# EasyEDA schematic Handheld.json
TITLE: Sheet_1; REV: 1.0; Date: 2025-04-20; Sheet: 1/1; Company: Your Company
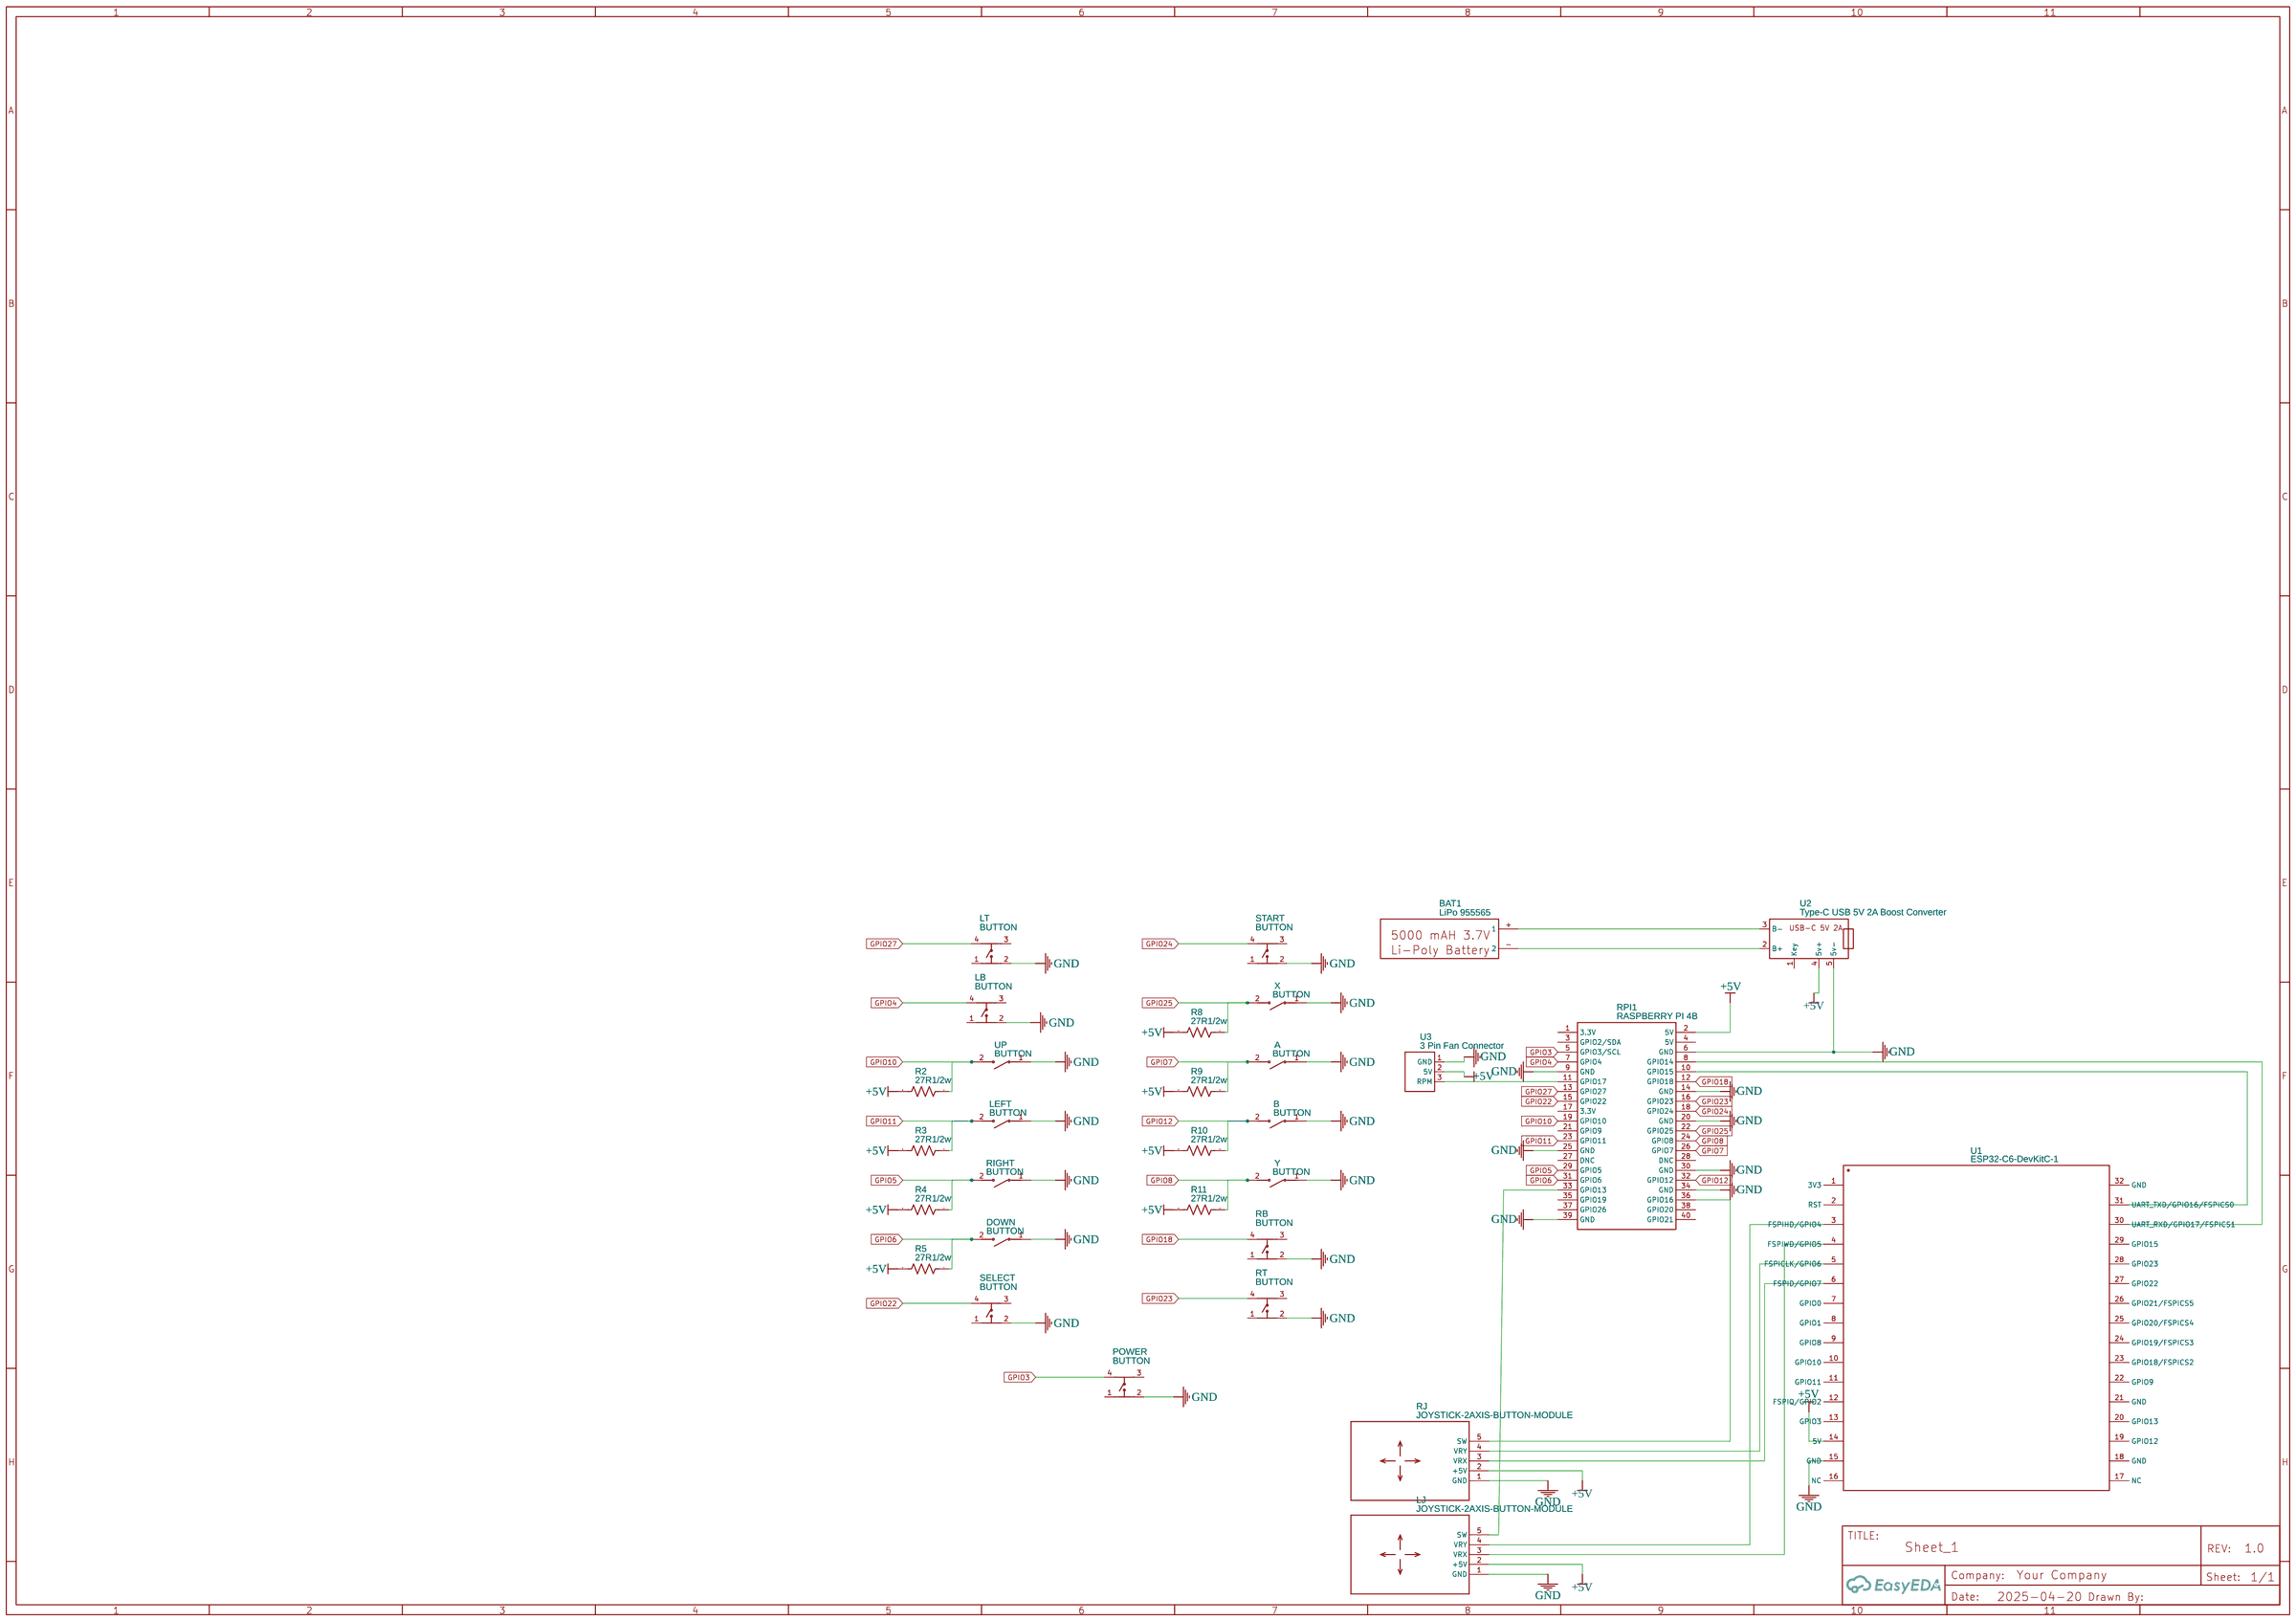
[diagram p0: schematic sheet]

## Parts
A  BUTTON  [SW-SMD_L3.9-W2.9-LS4.9-L]
B  BUTTON  [SW-SMD_L3.9-W2.9-LS4.9-L]
BAT1  LiPo 955565  [LIPO955565]
DOWN  BUTTON  [SW-SMD_L3.9-W2.9-LS4.9-L]
LB  BUTTON  [KEY-TH_4P-L6.0-W6.0-P4.50-LS7.5]
LEFT  BUTTON  [SW-SMD_L3.9-W2.9-LS4.9-L]
LJ  JOYSTICK-2AXIS-BUTTON-MODULE  [JOYSTICK-2AXIS-BUTTON-MODULE]
LT  BUTTON  [KEY-TH_4P-L6.0-W6.0-P4.50-LS7.5]
POWER  BUTTON  [KEY-TH_4P-L6.0-W6.0-P4.50-LS7.5]
R2  27R1/2w  [DC-RESISTOR-0.5W]
R3  27R1/2w  [DC-RESISTOR-0.5W]
R4  27R1/2w  [DC-RESISTOR-0.5W]
R5  27R1/2w  [DC-RESISTOR-0.5W]
R8  27R1/2w  [DC-RESISTOR-0.5W]
R9  27R1/2w  [DC-RESISTOR-0.5W]
R10  27R1/2w  [DC-RESISTOR-0.5W]
R11  27R1/2w  [DC-RESISTOR-0.5W]
RB  BUTTON  [KEY-TH_4P-L6.0-W6.0-P4.50-LS7.5]
RIGHT  BUTTON  [SW-SMD_L3.9-W2.9-LS4.9-L]
RJ  JOYSTICK-2AXIS-BUTTON-MODULE  [JOYSTICK-2AXIS-BUTTON-MODULE]
RPI1  RASPBERRY PI 4B  [RASPBERRYPI 4 FOOTPRINT BOBI]
RT  BUTTON  [KEY-TH_4P-L6.0-W6.0-P4.50-LS7.5]
SELECT  BUTTON  [KEY-TH_4P-L6.0-W6.0-P4.50-LS7.5]
START  BUTTON  [KEY-TH_4P-L6.0-W6.0-P4.50-LS7.5]
U1  ESP32-C6-DevKitC-1  [ESP32-C6-DEVKITC-1]
U2  Type-C USB 5V 2A Boost Converter  [NEW_FOOTPRINT]
U3  3 Pin Fan Connector  [3 PIN FAN CONNECTOR]
UP  BUTTON  [SW-SMD_L3.9-W2.9-LS4.9-L]
X  BUTTON  [SW-SMD_L3.9-W2.9-LS4.9-L]
Y  BUTTON  [SW-SMD_L3.9-W2.9-LS4.9-L]

## Library data of the parts
A B DOWN LEFT RIGHT UP X Y = BUTTON: Contributor: lcsc; Supplier: LCSC; Supplier Part: C9900015607; Manufacturer: null; JLCPCB Part Class: Extended Part
BAT1 = LiPo 955565: Supplier: AliExpress; link: https://fr.aliexpress.com/item/1005006267064316.html?spm=a2g0o.productlist.main.11.5d111150sK1gPE&algo_pvid=464ecfc5-47bd-4cfe-9f1d-5b2a3b254d35&algo_exp_id=464ecfc5-47bd-4cfe-9f1d-5b2a3b254d35-5&pdp_npi=4%40dis%21EUR%2118.36%2111.19%21%21%2119.40%2111.83%21%40211b65c917202114673735105e6bdf%2112000036534274948%21sea%21FR%21729477810%21&curPageLogUid=JP3qxg8w7FTU&utparam-url=scene%3Asearch%7Cquery_from%3A; Contributor: mathieu2509
LB LT POWER RB RT SELECT START = button6*6*8: Supplier Part: C59982; Supplier: LCSC; Manufacturer: ReliaPro; JLCPCB Part Class: Extended Part
LJ RJ = JOYSTICK-2AXIS-BUTTON-MODULE: Contributor: arenda1234
R2-R5 R8-R11 = Resistor-1/2w: Contributor: heaudio
RPI1 = RASPBERRY PI 4B: Manufacturer: Raspberry Pi; Supplier Part: 3775; Manufacturer Part: Raspberry Pi 4 Model B 2019 Quad Core 64 Bit WiFi Bluetooth (4GB); link: https://www.raspberrypi.com/products/raspberry-pi-4-model-b/; Convert to PCB: yes; Add into BOM: yes; Origin Footprint: HDR-20X2/2.54
U1 = ESP32-C6-DevKitC-1: Contributor: sebastian.gil
U2 = Type-C USB 5V 2A Boost Converter: Manufacturer: ELC5060; Manufacturer Part: ELC5060; Contributor: design2
U3 = 3 Pin Fan Connector: Manufacturer Part: PSS 254/3W; Contributor: herrrbert

## Nets
+5V: LJ.2(+5V) R2.2 R3.2 R4.2 R5.2 R8.2 R9.2 R10.2 R11.2 RJ.2(+5V) RPI1.2(5V) U1.14(5V) U2.4(5v+) U3.2(5V)
GND: A.1 B.1 DOWN.1 LB.2 LEFT.1 LJ.1(GND) LT.2 POWER.2 RB.2 RIGHT.1 RJ.1(GND) RPI1.6(GND) RPI1.9(GND) RPI1.14(GND) RPI1.20(GND) RPI1.25(GND) RPI1.30(GND) RPI1.34(GND) RPI1.39(GND) RT.2 SELECT.2 START.2 U1.15(GND) U2.5(5v-) U3.1(GND) UP.1 X.1 Y.1
GPIO3: POWER.4 RPI1.5(GPIO3/SCL)
GPIO4: LB.4 RPI1.7(GPIO4)
GPIO5: R4.1 RIGHT.2 RPI1.29(GPIO5)
GPIO6: DOWN.2 R5.1 RPI1.31(GPIO6)
GPIO7: A.2 R9.1 RPI1.26(GPIO7)
GPIO8: R11.1 RPI1.24(GPIO8) Y.2
GPIO10: R2.1 RPI1.19(GPIO10) UP.2
GPIO11: LEFT.2 R3.1 RPI1.23(GPIO11)
GPIO12: B.2 R10.1 RPI1.32(GPIO12)
GPIO18: RB.4 RPI1.12(GPIO18)
GPIO22: RPI1.15(GPIO22) SELECT.4
GPIO23: RPI1.16(GPIO23) RT.4
GPIO24: RPI1.18(GPIO24) START.4
GPIO25: R8.1 RPI1.22(GPIO25) X.2
GPIO27: LT.4 RPI1.13(GPIO27)
Net-(BAT1-+): BAT1.+(1) U2.3(B-)
Net-(BAT1--): BAT1.-(2) U2.2(B+)
Net-(LJ-3): LJ.3(VRX) U1.4(FSPIWD/GPIO5)
Net-(LJ-4): LJ.4(VRY) U1.3(FSPIHD/GPIO4)
Net-(LJ-5): LJ.5(SW) RPI1.33(GPIO13)
Net-(RJ-3): RJ.3(VRX) U1.6(FSPID/GPIO7)
Net-(RJ-4): RJ.4(VRY) U1.5(FSPICLK/GPIO6)
Net-(RJ-5): RJ.5(SW) RPI1.36(GPIO16)
Net-(RPI1-8): RPI1.8(GPIO14) U1.30(UART_RXD/GPIO17/FSPICS1)
Net-(RPI1-10): RPI1.10(GPIO15) U1.31(UART_TXD/GPIO16/FSPICS0)
Net-(RPI1-11): RPI1.11(GPIO17) U3.3(RPM)

Not connected (* = marked no-connect by the designer): LB 1 3; LT 1 3; POWER 1 3; RB 1 3; RPI1 1(3.3V) 3(GPIO2/SDA) 4(5V) 17(3.3V) 21(GPIO9) 27(DNC) 28(DNC) 35(GPIO19) 37(GPIO26) 38(GPIO20) 40(GPIO21); RT 1 3; SELECT 1 3; START 1 3; U1 1(3V3) 2(RST) 7(GPIO0) 8(GPIO1) 9(GPIO8) 10(GPIO10) 11(GPIO11) 12(FSPIQ/GPIO2) 13(GPIO3) 16(NC) 17(NC) 18(GND) 19(GPIO12) 20(GPIO13) 21(GND) 22(GPIO9) 23(GPIO18/FSPICS2) 24(GPIO19/FSPICS3) 25(GPIO20/FSPICS4) 26(GPIO21/FSPICS5) 27(GPIO22) 28(GPIO23) 29(GPIO15) 32(GND); U2 1(Key)
